# Altium schematic sheet SimpleIO.SchDoc
size A4
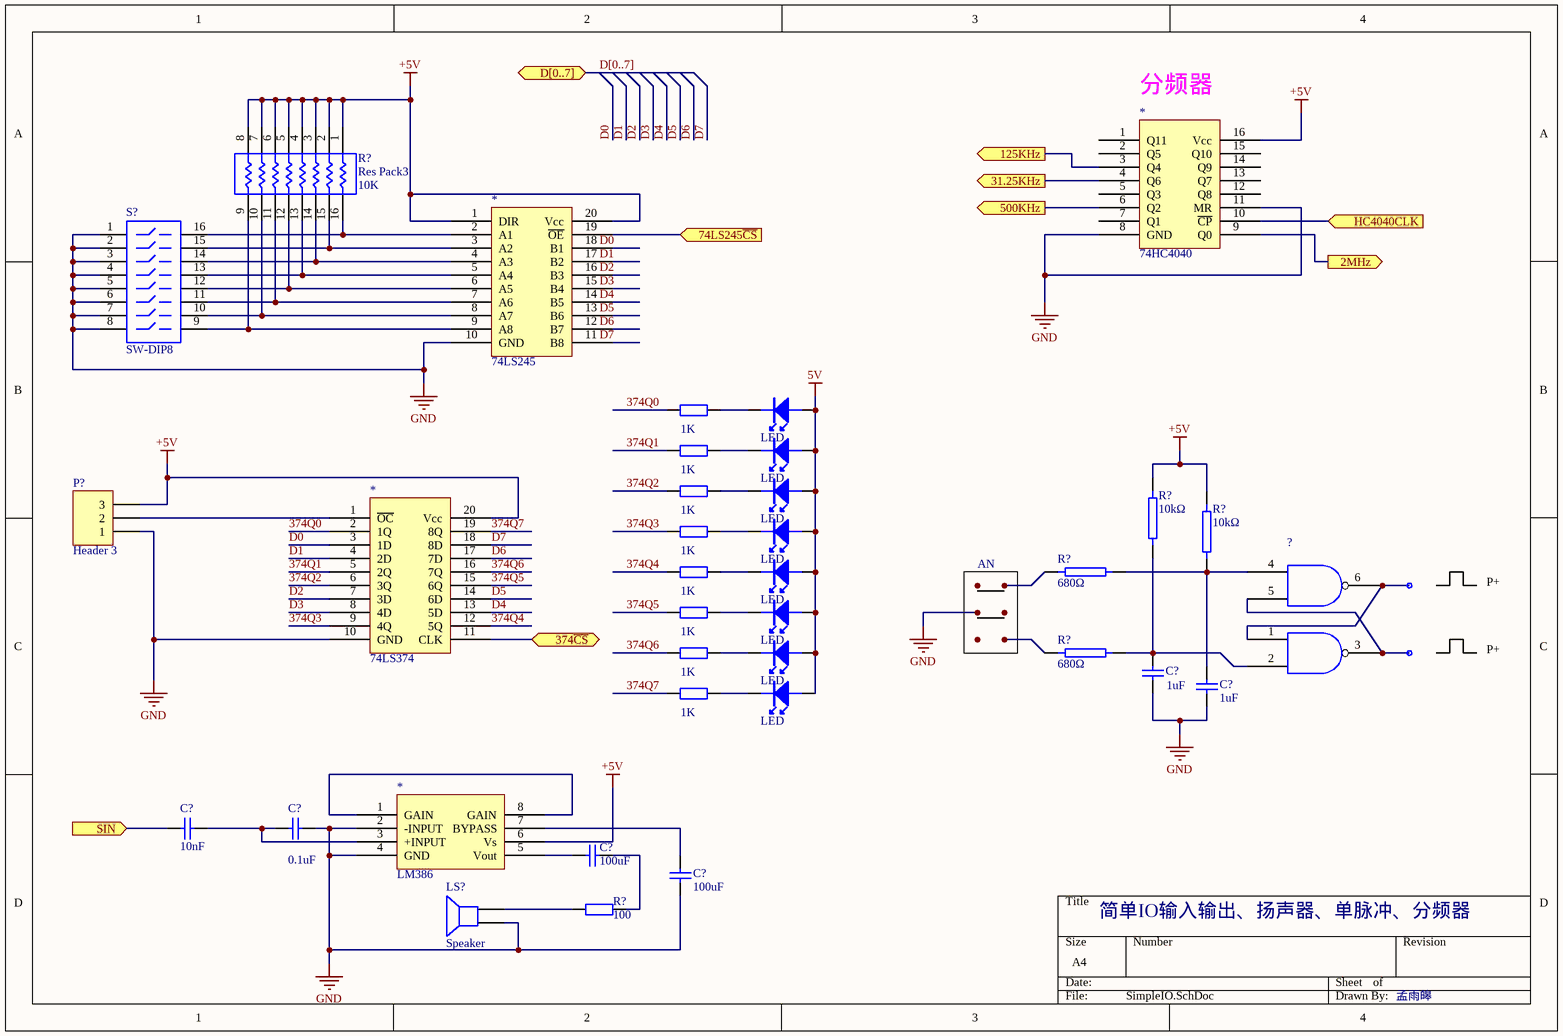
[diagram p0: SimpleIO.SchDoc]

## Parts
(Parts that share a designator on the sheet are numbered #1, #2 ... from top to bottom, then left to right.)
*#1  74HC4040
*#2  74LS245
*#3  74LS374
*#4  LM386
?  74LS00  (value not drawn)
C?#1  value 1uF  [RAD-0.3]
C?#2  value 1uF  [RAD-0.3]
C?#3  value 0.1uF  [RAD-0.3]
C?#4  value 10nF  [RAD-0.3]
C?#5  value 100uF  [RAD-0.3]
C?#6  value 100uF  [RAD-0.3]
D?#1  LED
D?#2  LED
D?#3  LED
D?#4  LED
D?#5  LED
D?#6  LED
D?#7  LED
D?#8  LED
LS?  Speaker  [PIN2]
P?  Header 3  [HDR1X3]
R?#1  Res Pack3  value 10K  [SO-16_N]
R?#2  value 1K  [AXIAL-0.4]  (hidden comment: Res2)
R?#3  value 1K  [AXIAL-0.4]  (hidden comment: Res2)
R?#4  value 1K  [AXIAL-0.4]  (hidden comment: Res2)
R?#5  value 1K  [AXIAL-0.4]  (hidden comment: Res2)
R?#6  10kΩ
R?#7  10kΩ
R?#8  value 1K  [AXIAL-0.4]  (hidden comment: Res2)
R?#9  680Ω
R?#10  value 1K  [AXIAL-0.4]  (hidden comment: Res2)
R?#11  value 1K  [AXIAL-0.4]  (hidden comment: Res2)
R?#12  680Ω
R?#13  value 1K  [AXIAL-0.4]  (hidden comment: Res2)
R?#14  value 100  [AXIAL-0.4]
S?  SW-DIP8  [DIP-16-KEY]

## Ports
2MHz (out), 31.25KHz (out), 74LS245~{CS} (in), 125KHz (out), 374~{CS}, 500KHz (out), D[0..7] (bidir), HC4040CLK (in), SIN (in)

## Nets
5V: D?#1.1 D?#2.1 D?#3.1 D?#4.1 D?#5.1 D?#6.1 D?#7.1 D?#8.1
+5V: *#1.16(Vcc) *#2.1(DIR) *#2.20(Vcc) *#3.20(Vcc) *#4.6(Vs) P?.3 R?#1.1 R?#1.2 R?#1.3 R?#1.4 R?#1.5 R?#1.6 R?#1.7 R?#1.8 R?#6.2 R?#7.2
GND: *#1.8(GND) *#1.11(MR) *#2.10(GND) *#3.10(GND) *#4.2(-INPUT) *#4.4(GND) C?#1.1 C?#2.1 C?#3.2 C?#6.1 LS?.1 P?.1 S?.1 S?.2 S?.3 S?.4 S?.5 S?.6 S?.7 S?.8
2MHz: *#1.9(Q0) ; port 2MHz
31.25KHz: *#1.4(Q6) ; port 31.25KHz
74LS245~{CS}: *#2.19(~{OE}) ; port 74LS245~{CS}
125KHz: *#1.3(Q4) ; port 125KHz
374~{CS}: *#3.11(CLK) ; port 374~{CS}
374Q0: *#3.2(1Q) R?#2.1
374Q1: *#3.5(2Q) R?#3.1
374Q2: *#3.6(3Q) R?#4.1
374Q3: *#3.9(4Q) R?#5.1
374Q4: *#3.12(5Q) R?#8.1
374Q5: *#3.15(6Q) R?#10.1
374Q6: *#3.16(7Q) R?#11.1
374Q7: *#3.19(8Q) R?#13.1
500KHz: *#1.6(Q2) ; port 500KHz
D0: *#3.3(1D)
D1: *#3.4(2D)
D2: *#3.7(3D)
D3: *#3.8(4D)
D4: *#3.13(5D)
D5: *#3.14(6D)
D6: *#3.17(7D)
D7: *#3.18(8D)
HC4040CLK: *#1.10(~{CP}) ; port HC4040CLK
SIN: C?#4.2 ; port SIN
Net*#2_2: *#2.2(A1) R?#1.16 S?.16
Net*#2_3: *#2.3(A2) R?#1.15 S?.15
Net*#2_4: *#2.4(A3) R?#1.14 S?.14
Net*#2_5: *#2.5(A4) R?#1.13 S?.13
Net*#2_6: *#2.6(A5) R?#1.12 S?.12
Net*#2_7: *#2.7(A6) R?#1.11 S?.11
Net*#2_8: *#2.8(A7) R?#1.10 S?.10
Net*#2_9: *#2.9(A8) R?#1.9 S?.9
Net*#3_1: *#3.1(~{OC}) P?.2
Net*#4_1: *#4.1(GAIN) *#4.8(GAIN)
Net*#4_3: *#4.3(+INPUT) C?#3.1 C?#4.1
Net*#4_5: *#4.5(Vout) C?#5.1
Net*#4_7: *#4.7(BYPASS) C?#6.2
Net?_1: ?.1 ?.6
Net?_2: ?.2 C?#1.2 R?#6.1 R?#12.2
Net?_3: ?.3 ?.5
Net?_4: ?.4 C?#2.2 R?#7.1 R?#9.2
NetC?#5_2: C?#5.2 R?#14.2
NetD?#1_2: D?#1.2 R?#2.2
NetD?#2_2: D?#2.2 R?#3.2
NetD?#3_2: D?#3.2 R?#4.2
NetD?#4_2: D?#4.2 R?#5.2
NetD?#5_2: D?#5.2 R?#8.2
NetD?#6_2: D?#6.2 R?#10.2
NetD?#7_2: D?#7.2 R?#11.2
NetD?#8_2: D?#8.2 R?#13.2
NetLS?_2: LS?.2 R?#14.1

Not connected (* = marked no-connect by the designer): *#1 1(Q11) 2(Q5) 5(Q3) 7(Q1) 12(Q8) 13(Q7) 14(Q9) 15(Q10); *#2 11(B8) 12(B7) 13(B6) 14(B5) 15(B4) 16(B3) 17(B2) 18(B1); R?#9 1; R?#12 1

## Buses and harness runs
bus D[0..7] = port D[0..7]

## Notes on the sheet
- (near *#1) 分频器
- AN
- P+
- 简单IO输入输出、扬声器、单脉冲、分频器
- 孟雨皞
- Labels drawn without touching a wire or pin: D0, D1, D2, D3, D4, D5, D6, D7

## Library data of the parts
C?#1-C?#6 = Cap: Capacitor; Published: 8-Jun-2000; LatestRevisionDate: 17-Jul-2002; LatestRevisionNote: Re-released for DXP Platform.; PackageReference: RAD-0.3; Publisher: Altium Limited
LS? = Speaker: Loudspeaker; Published: 24-Mar-1999; LatestRevisionDate: 17-Jul-2002; LatestRevisionNote: Re-released for DXP Platform.; PackageReference: PIN2; Publisher: Altium Limited
P? = Header 3: Header, 3-Pin; LatestRevisionDate: 17-Jul-2002; LatestRevisionNote: Re-released for DXP Platform.; Publisher: Altium Limited
R?#1 = Res Pack3: Isolated Resistor Network; Published: 24-Mar-1999; LatestRevisionDate: 29-May-2009; LatestRevisionNote: IPC-7351 Footprint Added.; PackageReference: SO-16; Publisher: Altium Limited; PackageDescription: 16-Pin Small Outline Integrated Circuit 1.27 mm Pitch; Code_JEDEC: MS-012-AC; Code_IPC: SOIC127P600-16
R?#2-R?#5 R?#8 R?#10 R?#11 R?#13 R?#14 = Res2: Resistor; Published: 8-Jun-2000; LatestRevisionDate: 17-Jul-2002; LatestRevisionNote: Re-released for DXP Platform.; PackageReference: AXIAL-0.4; Publisher: Altium Limited
  R?#2-R?#5 R?#8 R?#10 R?#11 R?#13: PackageDescription: Axial Device, Thru-Hole; 2 Leads; 0.4 in Pin Spacing
R?#6 R?#7 R?#9 R?#12 = 电阻
S? = SW-DIP8: 4009 Series DIP Switch, Raised actuator; Published: 24-Mar-1999; LatestRevisionDate: 17-Dec-2003; LatestRevisionNote: PCB Footprint replaced.; PackageReference: DIP-16-KEY; Publisher: Altium Limited; PackageDescription: DIP; 16 Leads; Row Spacing 7.62 mm; Pitch 2.54 mm; ComponentLink1Description: Manufacturer Link; ComponentLink1URL: http://www.oupiin.com/prodindx.html#Headers